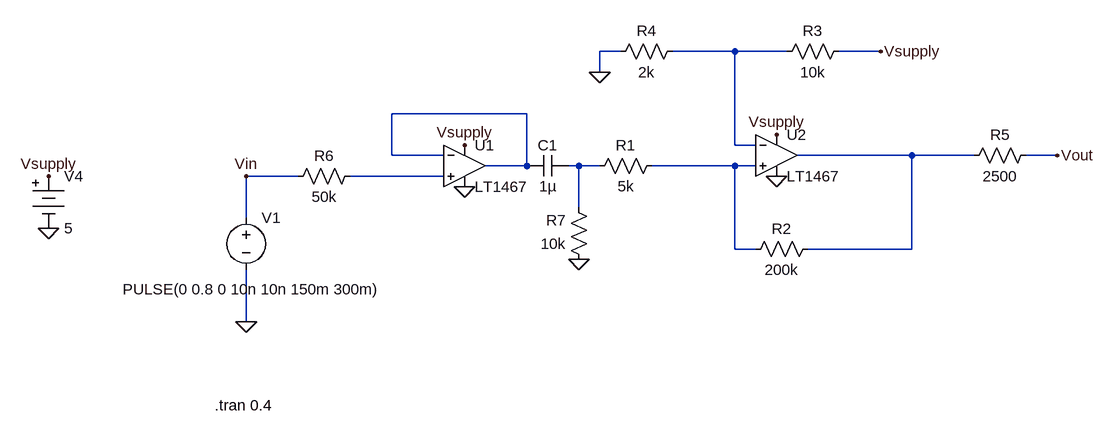
[diagram p0: schematic digitalcircuit.asc]
digitalcircuit.asc, the LTspice schematic file:
Version 4
SHEET 1 1684 680
WIRE 784 -80 752 -80
WIRE 960 -80 864 -80
WIRE 1040 -80 960 -80
WIRE 1184 -80 1120 -80
WIRE 752 -48 752 -80
WIRE 640 16 432 16
WIRE 960 64 960 -80
WIRE 992 64 960 64
WIRE 432 80 432 16
WIRE 512 80 432 80
WIRE 1232 80 1056 80
WIRE 1328 80 1232 80
WIRE 1456 80 1408 80
WIRE 640 96 640 16
WIRE 640 96 576 96
WIRE 720 96 704 96
WIRE 752 96 720 96
WIRE 960 96 832 96
WIRE 992 96 960 96
WIRE 288 112 208 112
WIRE 512 112 368 112
WIRE 720 160 720 96
WIRE 208 176 208 112
WIRE 960 224 960 96
WIRE 992 224 960 224
WIRE 1232 224 1232 80
WIRE 1232 224 1072 224
WIRE 208 336 208 256
FLAG 208 336 0
FLAG -96 192 0
FLAG -96 112 Vsupply
FLAG 544 64 Vsupply
FLAG 544 128 0
FLAG 208 112 Vin
FLAG 752 -48 0
FLAG 1024 112 0
FLAG 1024 48 Vsupply
FLAG 1184 -80 Vsupply
FLAG 1456 80 Vout
FLAG 720 240 0
SYMBOL voltage 208 160 R0
WINDOW 3 -190 126 Left 2
SYMATTR Value PULSE(0 0.8 0 10n 10n 150m 300m)
SYMATTR InstName V1
SYMBOL OpAmps/LT1467 544 32 R0
SYMATTR InstName U1
SYMBOL Misc/battery -96 96 R0
SYMATTR InstName V4
SYMATTR Value 5
SYMBOL Res 1424 64 R90
WINDOW 0 0 56 VBottom 2
WINDOW 3 32 56 VTop 2
SYMATTR InstName R5
SYMATTR Value 2500
SYMBOL Res 384 96 R90
WINDOW 0 0 56 VBottom 2
WINDOW 3 32 56 VTop 2
SYMATTR InstName R6
SYMATTR Value 50k
SYMBOL Res 848 80 R90
WINDOW 0 0 56 VBottom 2
WINDOW 3 32 56 VTop 2
SYMATTR InstName R1
SYMATTR Value 5k
SYMBOL Res 1088 208 R90
WINDOW 0 0 56 VBottom 2
WINDOW 3 32 56 VTop 2
SYMATTR InstName R2
SYMATTR Value 200k
SYMBOL OpAmps/LT1467 1024 16 R0
SYMATTR InstName U2
SYMBOL Res 1136 -96 R90
WINDOW 0 0 56 VBottom 2
WINDOW 3 32 56 VTop 2
SYMATTR InstName R3
SYMATTR Value 10k
SYMBOL Res 880 -96 R90
WINDOW 0 0 56 VBottom 2
WINDOW 3 32 56 VTop 2
SYMATTR InstName R4
SYMATTR Value 2k
SYMBOL Cap 704 80 R90
WINDOW 0 0 32 VBottom 2
WINDOW 3 32 32 VTop 2
SYMATTR InstName C1
SYMATTR Value 1µ
SYMBOL Res 736 256 R180
WINDOW 0 36 76 Left 2
WINDOW 3 36 40 Left 2
SYMATTR InstName R7
SYMATTR Value 10k
TEXT 160 464 Left 2 !.tran 0.4

The netlist it stands for:
* digitalcircuit.asc
V1 Vin 0 PULSE(0 0.8 0 10n 10n 150m 300m)
XU1 N006 N002 Vsupply 0 N002 LT1467  ; pins In+ In- V+ V- OUT
V4 Vsupply 0 5
R5 Vout N003 2500
R6 N006 Vin 50k
R1 N005 N004 5k
R2 N003 N005 200k
XU2 N005 N001 Vsupply 0 N003 LT1467  ; pins In+ In- V+ V- OUT
R3 Vsupply N001 10k
R4 N001 0 2k
C1 N004 N002 1µ
R7 0 N004 10k
.tran 0.4
.backanno
.end